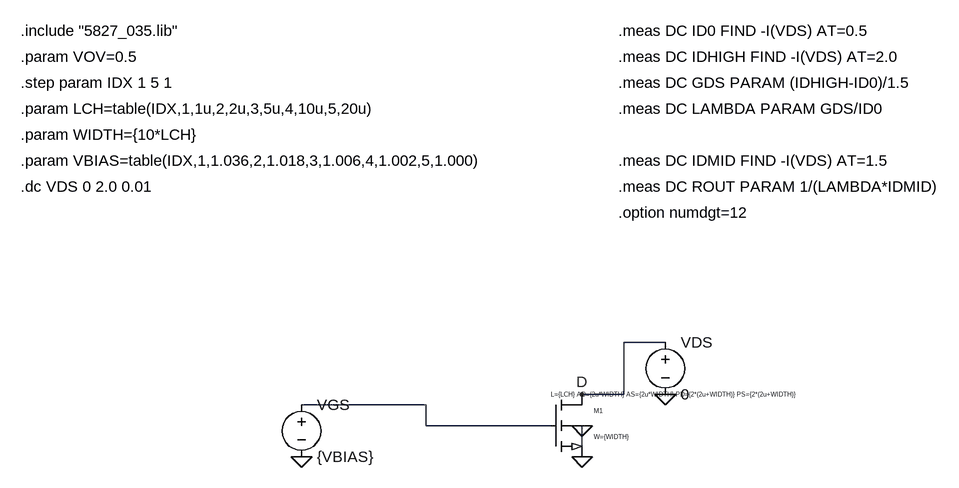
[diagram p0: schematic SIM2_2_NMOS.asc]
SIM2_2_NMOS.asc, the LTspice schematic file:
Version 4.1
SHEET 1 880 680
WIRE -128 176 64 176
WIRE 64 176 64 208
WIRE 64 208 256 208
WIRE 304 160 368 160
WIRE 368 80 368 160
WIRE 368 80 432 80
WIRE 304 208 304 256
FLAG -128 256 0
FLAG 304 160 D
FLAG 304 208 0
FLAG 304 256 0
FLAG 432 160 0
SYMBOL nmos_035 256 160 R0
SYMATTR InstName M1
SYMATTR Value2 W={WIDTH}
SYMATTR SpiceLine L={LCH} AD={2u*WIDTH} AS={2u*WIDTH} PD={2*(2u+WIDTH)} PS={2*(2u+WIDTH)}
SYMBOL voltage -128 160 R0
WINDOW 123 0 0 Left 0
WINDOW 39 0 0 Left 0
SYMATTR InstName VGS
SYMATTR Value {VBIAS}
SYMBOL voltage 432 64 R0
WINDOW 123 0 0 Left 0
WINDOW 39 0 0 Left 0
SYMATTR InstName VDS
SYMATTR Value 0
TEXT -560 -400 Left 2 !.include "5827_035.lib"
TEXT -560 -360 Left 2 !.param VOV=0.5
TEXT -560 -320 Left 2 !.step param IDX 1 5 1
TEXT -560 -280 Left 2 !.param LCH=table(IDX,1,1u,2,2u,3,5u,4,10u,5,20u)
TEXT -560 -240 Left 2 !.param WIDTH={10*LCH}
TEXT -560 -200 Left 2 !.param VBIAS=table(IDX,1,1.036,2,1.018,3,1.006,4,1.002,5,1.000)
TEXT -560 -160 Left 2 !.dc VDS 0 2.0 0.01
TEXT 360 -400 Left 2 !.meas DC ID0 FIND -I(VDS) AT=0.5
TEXT 360 -360 Left 2 !.meas DC IDHIGH FIND -I(VDS) AT=2.0
TEXT 360 -320 Left 2 !.meas DC GDS PARAM (IDHIGH-ID0)/1.5
TEXT 360 -280 Left 2 !.meas DC LAMBDA PARAM GDS/ID0
TEXT 360 -200 Left 2 !.meas DC IDMID FIND -I(VDS) AT=1.5
TEXT 360 -160 Left 2 !.meas DC ROUT PARAM 1/(LAMBDA*IDMID)
TEXT 360 -120 Left 2 !.option numdgt=12

The netlist it stands for:
* SIM2_2_NMOS.asc
M1 D N001 0 0 NM W={WIDTH} L={LCH} AD={2u*WIDTH} AS={2u*WIDTH} PD={2*(2u+WIDTH)} PS={2*(2u+WIDTH)}
VGS N001 0 {VBIAS}
VDS D 0 0
.model NMOS NMOS
.model PMOS PMOS
.lib standard.mos
.include "5827_035.lib"
.param VOV=0.5
.step param IDX 1 5 1
.param LCH=table(IDX,1,1u,2,2u,3,5u,4,10u,5,20u)
.param WIDTH={10*LCH}
.param VBIAS=table(IDX,1,1.036,2,1.018,3,1.006,4,1.002,5,1.000)
.dc VDS 0 2.0 0.01
.meas DC ID0 FIND -I(VDS) AT=0.5
.meas DC IDHIGH FIND -I(VDS) AT=2.0
.meas DC GDS PARAM (IDHIGH-ID0)/1.5
.meas DC LAMBDA PARAM GDS/ID0
.meas DC IDMID FIND -I(VDS) AT=1.5
.meas DC ROUT PARAM 1/(LAMBDA*IDMID)
.option numdgt=12
.backanno
.end